# EAGLE design mainboard_3 (EAGLE 7.3.0)
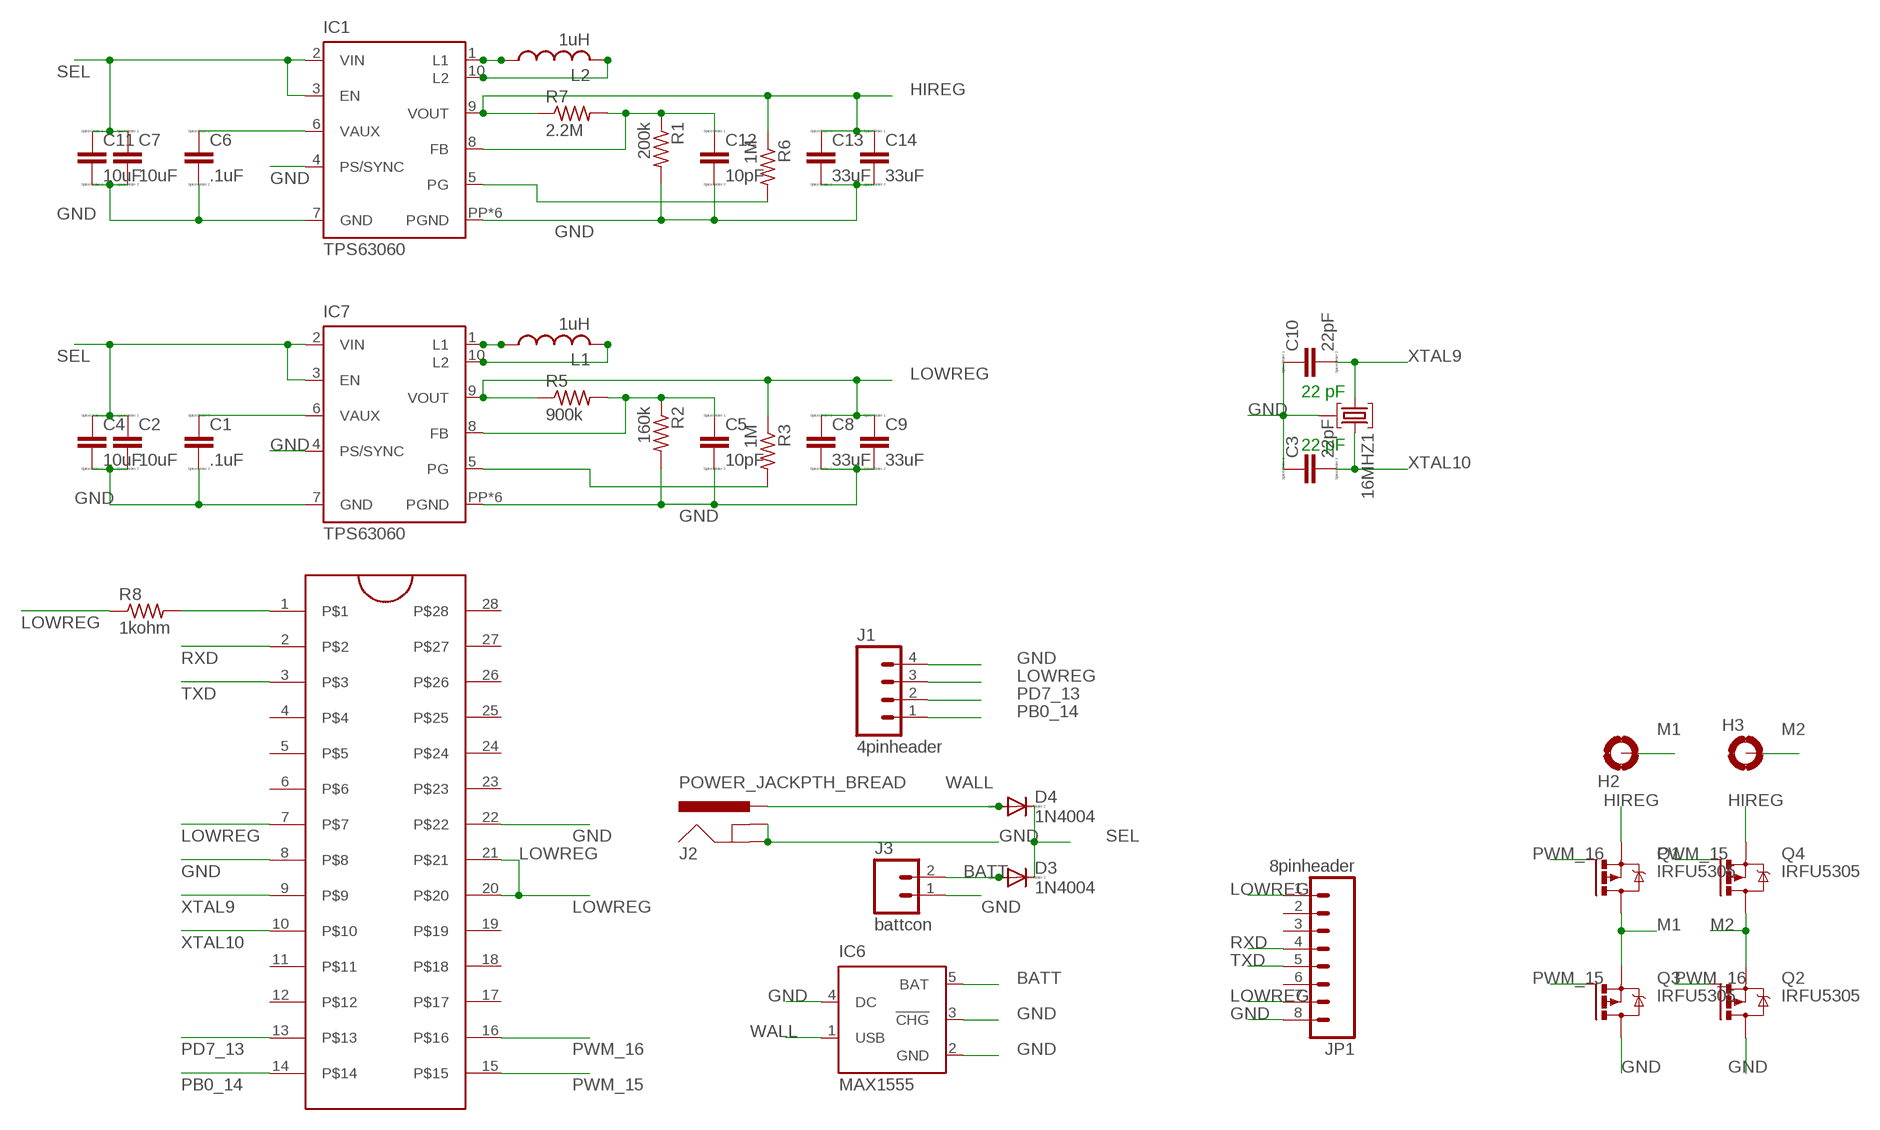
[diagram p0: schematic, sheet 1]

## Parts
16MHZ1  HC49-HC49-3L  [HC49-3L]
C1  .1uF  C  [C0805]
C2  10uF  CC3216  [C3216]
C3  22pF  C  [C0805]
C4  10uF  CC3216  [C3216]
C5  10pF  CC1206  [C1206]
C6  .1uF  C  [C0805]
C7  10uF  CC3216  [C3216]
C8  33uF  CC3216  [C3216]
C9  33uF  CC3216  [C3216]
C10  22pF  C  [C0805]
C11  10uF  CC3216  [C3216]
C12  10pF  CC1206  [C1206]
C13  33uF  CC3216  [C3216]
C14  33uF  CC3216  [C3216]
D3  1N4004  [DO41-10]
D4  1N4004  [DO41-10]
H2  MOUNT-PAD-ROUND4.1  [4,1-PAD]
H3  MOUNT-PAD-ROUND4.1  [4,1-PAD]
IC1  TPS63060  [DSC-S-PWSON-N10]
IC6  MAX1555  [SOT23-5L]
IC7  TPS63060  [DSC-S-PWSON-N10]
J1  4pinheader  M04LONGPADS  [1X04_LONGPADS]
J2  POWER_JACKPTH_BREAD  [POWER_JACK_PTH_BREAD]
J3  battcon  M02JST-PTH-VERT  [JST-2-PTH-VERT]
JP1  8pinheader  M08LONGPADS  [1X08_LONGPADS]
L1  1uH  L-USL4532P  [L4532P]
L2  1uH  L-USL4532P  [L4532P]
Q1  IRFU5305  [I-PAK_TO251AA]
Q2  IRFU5305  [I-PAK_TO251AA]
Q3  IRFU5305  [I-PAK_TO251AA]
Q4  IRFU5305  [I-PAK_TO251AA]
R1  200k  R-US_M0805  [M0805]
R2  160k  R-US_M0805  [M0805]
R3  1M  R-US_M0805  [M0805]
R5  900k  R-US_M3216  [M3216]
R6  1M  R-US_M0805  [M0805]
R7  2.2M  R-US_M3216  [M3216]
R8  1kohm  R-US_M0805  [M0805]
U$1  ZIFSOCKET-28-3ZIFFSOCKET-28-3  [DIL28-3-ZIF_SOCKET]

## Nets
BATT: D3.A IC6.5(BAT) J3.2
GND: 16MHZ1.2 C1.2 C2.2 C3.1 C4.2 C5.2 C6.2 C7.2 C8.2 C9.2 C10.1 C11.2 C12.2 C13.2 C14.2 IC1.4(PS/SYNC) IC1.7(GND) IC1.PP(PGND) IC1.PP@1(PGND) IC1.PP@2(PGND) IC1.PP@3(PGND) IC1.PP@4(PGND) IC1.PP@7(PGND) IC6.2(GND) IC6.3(!CHG) IC6.4(DC) IC7.4(PS/SYNC) IC7.7(GND) IC7.PP(PGND) IC7.PP@1(PGND) IC7.PP@2(PGND) IC7.PP@3(PGND) IC7.PP@4(PGND) IC7.PP@7(PGND) J1.4 J2.GND J2.GNDBREAK J3.1 JP1.8 Q2.2(D) Q3.2(D) R1.2 R2.2 U$1.8 U$1.22
HIREG: C13.1 C14.1 IC1.9(VOUT) Q1.3(S) Q4.3(S) R6.1 R7.1
LOWREG: C8.1 C9.1 IC7.9(VOUT) J1.3 JP1.1 JP1.7 R3.1 R5.1 R8.1 U$1.7 U$1.20 U$1.21
M1: H2.B4,1(MOUNT) Q1.2(D) Q3.3(S)
M2: H3.B4,1(MOUNT) Q2.3(S) Q4.2(D)
N$1: R8.2 U$1.1
N$3: IC1.1(L1) L2.1
N$4: IC7.1(L1) L1.1
N$5: IC7.10(L2) L1.2
N$8: IC1.10(L2) L2.2
N$9: C5.1 IC7.8(FB) R2.1 R5.2
N$10: C12.1 IC1.8(FB) R1.1 R7.2
N$11: C1.1 IC7.6(VAUX)
N$12: IC1.5(PG) R6.2
N$13: IC7.5(PG) R3.2
N$14: C6.1 IC1.6(VAUX)
PB0_14: J1.1 U$1.14
PD7_13: J1.2 U$1.13
PWM_15: Q3.1(G) Q4.1(G) U$1.15
PWM_16: Q1.1(G) Q2.1(G) U$1.16
RXD: JP1.4 U$1.2
SEL: C2.1 C4.1 C7.1 C11.1 D3.C D4.C IC1.2(VIN) IC1.3(EN) IC7.2(VIN) IC7.3(EN)
TXD: JP1.5 U$1.3
WALL: D4.A IC6.1(USB) J2.PWR
XTAL9: 16MHZ1.1 C10.2 U$1.9
XTAL10: 16MHZ1.3 C3.2 U$1.10
Unconnected: JP1.2 JP1.3 JP1.6 U$1.4 U$1.5 U$1.6 U$1.11 U$1.12 U$1.17 U$1.18 U$1.19 U$1.23 U$1.24 U$1.25 U$1.26 U$1.27 U$1.28

## Notes on the sheet
- 22 pF
- 22 pF

## Library data of the parts
16MHZ1 = IQD-Frequency-Products:HC49: Crystals; MFD: IQD Frequency Products
C1-C14 = eagle-ltspice:C: CAPACITOR, European symbol; SPICEMODEL: NONE; SPICEPREFIX: C
D3 D4 = diode:1N4004: DIODE general purpose rectifier, 1 A
H2 H3 = holes:MOUNT-PAD-ROUND: MOUNTING PAD, round
IC1 IC7 = ARNAV445:TPS6306*: HIGH INPUT VOLTAGE BUCK-BOOST CONVERTER WITH 2A SWITCH CURRENT Source: http://www.ti.com/lit/ds/symlink/tps63060.pdf
IC6 = maxim:MAX1555: Dual-Input USB/AC Adapter 1-Cell Li+ Battery Chargers Source: http://www.maxim-ic.com .. MAX1551-MAX1555.pdf; MF: MAXIM; MPN: MAX1555EZK+T; OC_FARNELL: 1628222; OC_NEWARK: 59J2761
J1 = SparkFun-Connectors:M04: Header 4 Standard 4-pin 0.1" header. Use with straight break away headers (SKU : PRT-00116), right angle break away headers (PRT-00553), swiss pins (PRT-00743), machine pins (PRT-00117), and female headers (PRT-00115). Molex polarized connector foot print use with SKU : PRT-08231 with associated crimp pins and housings. 1MM SMD Version SKU: PRT-10208; PROD_ID: CONN-09696
J2 = SparkFun-Connectors:POWER_JACK: Power Jack This is the standard 5.5mm barrel jack for power. The PTH is the most common, proven, reliable, footprint. The Slot footprint only works if the mill layer is transmitted to the PCB fab house so be warned. Mating wall wart : TOL-00298 (and others); PROD_ID: PRT-10811
J3 = SparkFun-Connectors:M02: Standard 2-pin 0.1" header. Use with - straight break away headers ( PRT-00116) - right angle break away headers (PRT-00553) - swiss pins (PRT-00743) - machine pins (PRT-00117) - female headers (PRT-00115) Molex polarized connector foot print use with: PRT-08233 with associated crimp pins and housings. 2.54_SCREWTERM for use with PRT-10571. 3.5mm Screw Terminal footprints for PRT-08084 5mm Screw Terminal footprints for use with PRT-08432
JP1 = SparkFun-Connectors:M08: Header 8 Standard 8-pin 0.1" header. Use with straight break away headers (SKU : PRT-00116), right angle break away headers (PRT-00553), swiss pins (PRT-00743), machine pins (PRT-00117), and female headers (PRT-00115).
L1 L2 = rcl:L-US: INDUCTOR, American symbol
Q1-Q4 = transistor-power:IRF?5305: HEXFET Power MOSFET Source: http://www.irf.com/product-info/datasheets/data/irfr5305pbf.pdf
R1-R3 R5-R8 = rcl:R-US_: RESISTOR, American symbol
U$1 = SparkFun-Connectors:ZIFSOCKET-28-3: Lever-action ZIF socket for 28-pin ICs

## Board
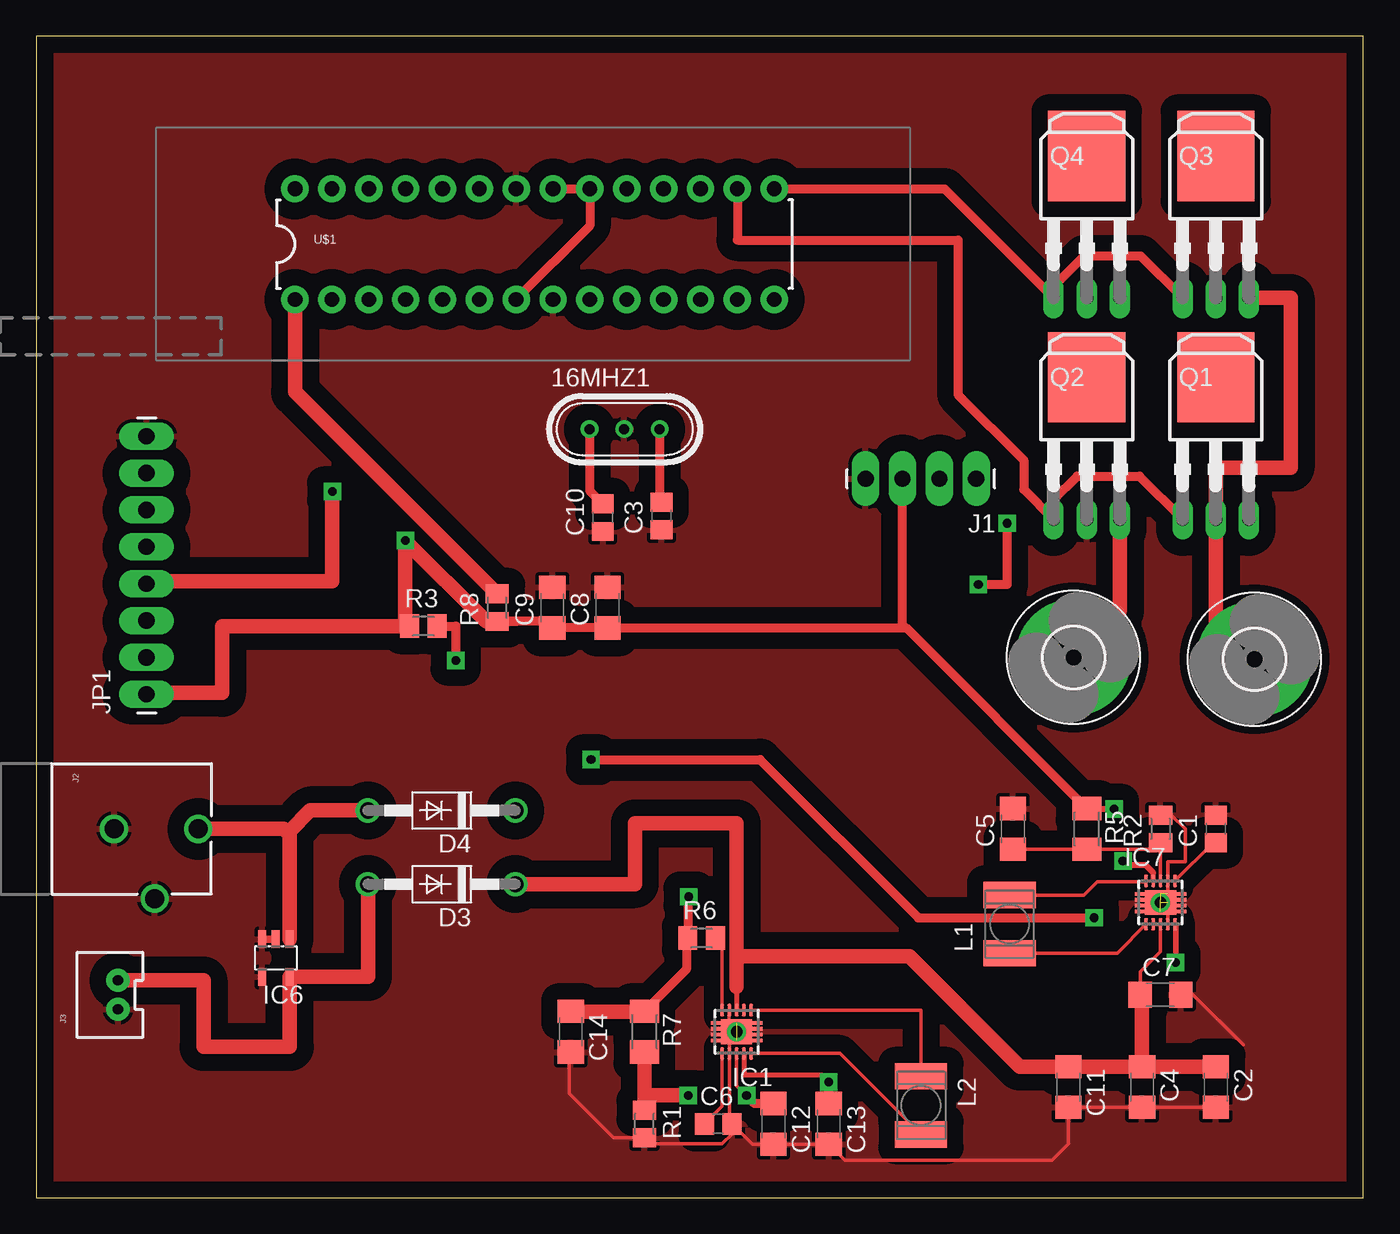
[diagram p1: board, top side]
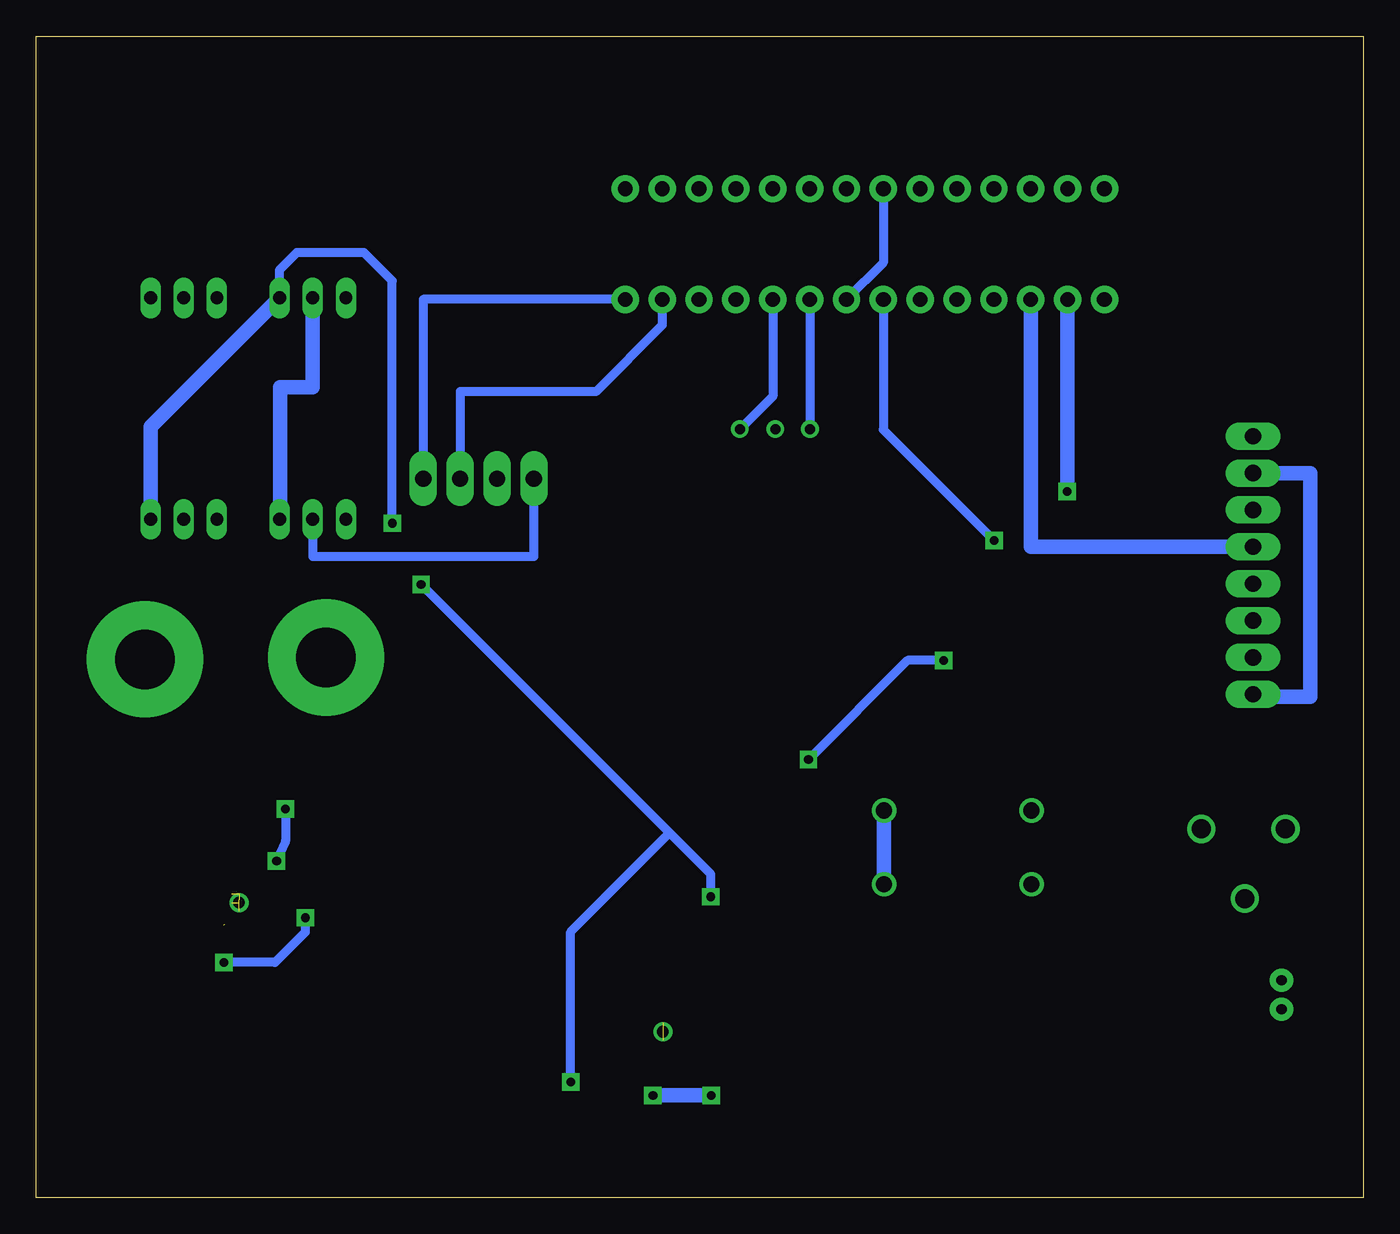
[diagram p2: board, bottom side, seen from below]

Size 91.44 x 80 mm. Coordinates in mm from the lower left corner, seen from the top.
Outline: 0,0 91.44,0 91.44,80 0,80 0,0
Copper layers (1*16): Top 0.035mm / dielectric 1.5mm / Bottom 0.035mm
Design rules "MWSEagleDesignRules2": minimum track width 13mil, minimum drill 22mil, track to track 13mil, track to pad 13mil, pad to pad 13mil, via to via 13mil, smd to smd 8mil, copper to edge 40mil, drill to drill 8mil, minimum pad ring 10mil, minimum via ring 8mil, stop-mask expansion 4mil, vias tented up to drill 0mil, thermal gap 10mil

### Footprints (pad centres in the part's own frame; a part is rotated, then mirrored left to right if it is on the bottom)
HC49-3L = drill 0.7 pad 1.2: 1 -2.413,0; 2 -0.027,0; 3 2.413,0
C0805 = smd 1.3 x 1.5: 1 -0.95,0; 2 0.95,0
C3216 = smd 1.6 x 1.8: 1 -1.4,0; 2 1.4,0
C1206 = smd 1.6 x 1.8: 1 -1.4,0; 2 1.4,0
DO41-10 = drill 1.118: A 5.08,0; C -5.08,0
4,1-PAD = drill 4.1 pad 8: B4,1 0,0
DSC-S-PWSON-N10 = smd 0.28 x 0.85: 1 -1,-1.488; 2 -0.5,-1.488; 3 0,-1.488; 4 0.5,-1.488; 5 1,-1.488; 6 1,1.5; 7 0.5,1.5; 8 0,1.5; 9 -0.5,1.5; 10 -1,1.5 | smd 2.15 x 1.7: PP 0,0 | smd 3.55 x 0.25: PP@1 0,0.6; PP@2 0,0.2; PP@3 0,-0.2; PP@4 0,-0.6 | drill 0.8: PP@7 0,0
SOT23-5L = smd 0.55 x 1.2: 1 -0.95,-1.3; 2 0,-1.3; 3 0.95,-1.3; 4 0.95,1.3; 5 -0.95,1.3
1X04_LONGPADS = drill 1.118 pad 1.88 long: 1 0,0; 2 2.54,0; 3 5.08,0; 4 7.62,0
POWER_JACK_PTH_BREAD = drill 1.3: GND 0,7.9; GNDBREAK 4.8,10.7; PWR 0,13.7
JST-2-PTH-VERT = drill 0.7 pad 1.6: 1 -1,-0.55; 2 1,-0.55
1X08_LONGPADS = drill 1.118 pad 1.88 long: 1 0,0; 2 2.54,0; 3 5.08,0; 4 7.62,0; 5 10.16,0; 6 12.7,0; 7 15.24,0; 8 17.78,0
L4532P = smd 1.8 x 3.6: 1 -2,0; 2 2,0
I-PAK_TO251AA = drill 0.889 long: 1 -2.286,-5.334; 2 0,-5.334; 3 2.286,-5.334 | smd 5.334 x 6.223: 4 0,4.445
M0805 = smd 1.3 x 1.6: 1 -0.95,0; 2 0.95,0
M3216 = smd 1.6 x 2: 1 -1.4,0; 2 1.4,0
DIL28-3-ZIF_SOCKET = drill 1.016 pad 1.88: 1 -16.51,-3.81; 2 -13.97,-3.81; 3 -11.43,-3.81; 4 -8.89,-3.81; 5 -6.35,-3.81; 6 -3.81,-3.81; 7 -1.27,-3.81; 8 1.27,-3.81; 9 3.81,-3.81; 10 6.35,-3.81; 11 8.89,-3.81; 12 11.43,-3.81; 13 13.97,-3.81; 14 16.51,-3.81; 15 16.51,3.81; 16 13.97,3.81; 17 11.43,3.81; 18 8.89,3.81; 19 6.35,3.81; 20 3.81,3.81; 21 1.27,3.81; 22 -1.27,3.81; 23 -3.81,3.81; 24 -6.35,3.81; 25 -8.89,3.81; 26 -11.43,3.81; 27 -13.97,3.81; 28 -16.51,3.81

### Placement (x,y rotation side)
16MHZ1  40.54,52.93 0 top
C1  81.28,25.4 90 top
C2  81.28,7.62 270 top
C3  43.08,46.96 90 top
C4  76.2,7.62 270 top
C5  67.31,25.4 90 top
C6  46.99,5.08 0 top
C7  77.47,13.97 0 top
C8  39.37,40.64 90 top
C9  35.56,40.64 90 top
C10  39.04,46.84 90 top
C11  71.12,7.62 270 top
C12  50.8,5.08 270 top
C13  54.61,5.08 270 top
C14  36.83,11.43 270 top
D3  27.94,21.59 180 top
D4  27.94,26.67 180 top
H2  83.95,37.08 0 top
H3  71.48,37.21 0 top
IC1  48.26,11.43 180 top
IC6  16.51,16.51 180 top
IC7  77.47,20.32 0 top
J1  64.77,49.53 180 top
J2  -2.54,25.4 270 top
J3  5.08,13.97 90 top
JP1  7.59,34.67 90 top
L1  67.08,18.85 90 top
L2  60.96,6.35 270 top
Q1  81.28,52.07 0 top
Q2  72.39,52.07 0 top
Q3  81.28,67.31 0 top
Q4  72.39,67.31 0 top
R1  41.91,5.08 270 top
R2  77.47,25.4 90 top
R3  26.67,39.37 0 top
R5  72.39,25.4 270 top
R6  45.85,17.88 0 top
R7  41.91,11.43 270 top
R8  31.75,40.64 90 top
U$1  34.34,65.68 0 top

### Tracks (layer width: path | path; a pad name or v marks a point on that pad's centre or on a via)
BATT
  Top 1.016: D3.A 22.86,15.21 IC6.5 17.46,10.39 11.53,10.39 11.53,14.97 J3.2
GND  (10 unrouted)
  Top 0.254: 81.33,6.27 C2.2 C4.2 C11.2 71.12,3.71 69.98,2.57 55.72,2.57 C13.2 C12.2 49.34,3.68 C6.2 | C7.2 79.7,13.97 83.16,10.52 | C14.2 36.73,9.93 36.73,7.19 39.79,4.13 R1.2 42.33,3.71 47.27,3.71 47.94,4.38 C6.2 | C10.1 39.26,45.89 | R2.2 78.22,26.35 79.17,25.4 79.17,23.14 77.97,23.14 IC7.7 | 77.93,21.86 IC7.7 | 77.97,20.92 IC7.7 | 77.97,20.32 IC7.4 | C6.2 47.76,5.08 IC1.7 47.76,10.83 IC1.PP@1 | IC1.4 47.75,11.43 IC1.PP@7
  Top 0.508: IC6.3 IC6.2
  Bottom 0.61: Q2.2 72.39,44.17 57.15,44.17 J1.4 | U$1.22 33.07,64.41 U$1.8
  pour Top (isolate 1.143): 1.27,78.74 90.17,78.74 90.17,1.27 1.27,1.27
HIREG  (via drill 0.6)
  Top 0.254: 41.88,12.8 R7.1
  Top 0.356: v54.61,7.98 54.13,8.46 48.76,8.46 IC1.9
  Top 0.61: v44.96,20.73 44.96,17.88 R6.1 44.81,17.78 44.81,15.73 R7.1 | v64.92,42.24 66.9,42.24 v66.9,46.46 | C13.1 v54.61,7.98
  Top 1.016: 41.88,12.8 36.83,12.8 C14.1
  Bottom 0.61: v44.96,20.73 44.96,22.28 47.8,25.12 | 47.8,25.12 v64.92,42.24 | v66.9,46.46 66.9,63.14 68.86,65.1 73.48,65.1 74.7,63.88 74.7,62 Q4.3 | v54.61,7.98 54.61,18.31 47.8,25.12
  Bottom 1.016: Q1.3 83.57,53.09 Q4.3
LOWREG  (via drill 0.6)
  Top 0.254: 74.24,26.8 v74.27,26.77 | 35.56,39.69 C9.1 | 76.99,21.82 IC7.9
  Top 0.356: IC7.9 76.97,22.39
  Top 0.381: 76.97,22.39 76.45,22.91
  Top 0.406: R5.1 74.24,26.8 | 76.45,22.91 75.16,22.91 v74.88,23.19
  Top 0.61: C9.1 C8.1 59.69,39.24 | 35.56,39.69 R8.1 33.07,39.69 | 59.69,39.24 J1.3 | 59.69,39.24 59.95,39.24 R5.1 | U$1.7 38.15,66.95 U$1.20 U$1.21 | 25.43,39.66 R3.1
  Top 1.016: 25.43,39.66 v25.43,45.26 31,39.69 R8.1 | R3.1 12.8,39.37 12.8,34.77 7.6,34.77 JP1.1
  Bottom 0.254: 7.6,49.99 JP1.7
  Bottom 0.61: v74.27,26.77 74.27,24.56 v74.88,23.19 | U$1.7 33.07,52.91 v25.43,45.26
  Bottom 1.016: JP1.7 3.63,49.91 3.63,34.52 7.6,34.52 JP1.1
M1
  Top 1.016: H2.B4,1 81.28,39.75 Q1.2 81.28,50.29 86.44,50.29 86.44,61.98 Q3.3
M2
  Top 1.016: Q2.3 74.68,40.41 H3.B4,1
  Bottom 1.016: Q2.3 74.62,46.74 74.62,55.83 72.39,55.83 Q4.2
N$1
  Top 1.016: U$1.1 17.83,55.51 R8.2
N$3
  Top 0.254: IC1.1 60.96,12.92 L2.1
N$4
  Top 0.254: L1.1 74.48,16.85 IC7.1
N$5
  Top 0.254: L1.2 72.21,20.85 73.13,21.77 76.42,21.77 IC7.10 76.45,21.82
N$8
  Top 0.254: L2.2 55.38,9.93 IC1.10
N$9
  Top 0.254: C5.1 R5.2 77.02,24 R2.1 IC7.8
N$10  (via drill 0.6)
  Top 0.254: 48.26,9.02 IC1.8 48.26,7.72 v48.95,7.04
  Top 0.61: C12.1 49.5,6.48 v48.95,7.04
  Top 1.016: R7.2 41.91,7.04 | 41.91,7.04 R1.1 | v44.93,7.04 41.91,7.04
  Bottom 1.016: v44.93,7.04 v48.95,7.04
N$11
  Top 0.254: C1.1 81.1,24.45 IC7.6
N$12
  Top 0.254: R6.2 47.26,17.88 IC1.5
N$13  (via drill 0.6)  (1 unrouted)
  Top 0.381: v78.51,16.21 78.51,18.79
  Top 0.61: R3.2 28.9,39.37 v28.9,37.01 | v38.23,30.18 49.89,30.18 60.78,19.28 v72.9,19.28
  Bottom 0.61: v28.9,37.01 31.39,37.01 v38.23,30.18 | v72.9,19.28 72.9,18.29 74.98,16.21 v78.51,16.21
N$14
  Top 0.254: IC1.6 47.26,6.3 C6.1
PB0_14
  Bottom 0.61: U$1.14 64.77,61.87 J1.1
PD7_13
  Bottom 0.61: U$1.13 48.31,60.1 52.88,55.52 62.23,55.52 J1.2
PWM_15
  Top 0.61: U$1.15 62.59,69.49 Q4.1 70.1,62.76 72.21,64.87 76.1,64.87 Q3.1
PWM_16
  Top 0.61: U$1.16 48.31,65.96 63.52,65.96 63.52,55.32 68.05,50.8 68.05,48.79 Q2.1 70.1,48.08 71.73,49.71 76.02,49.71 Q1.1
RXD  (via drill 0.6)
  Top 1.016: v20.4,48.64 20.4,42.47 7.6,42.47 JP1.4
  Bottom 1.016: U$1.2 20.4,61.87 v20.4,48.64
SEL
  Top 0.254: 76.07,9.15 C4.1 | IC1.3 IC1.2 | IC7.2 IC7.3 77.44,18.81 77.44,16.94 76.07,15.57 C7.1
  Top 0.356: 48.26,14.53 IC1.3
  Top 1.016: D3.C 41.25,21.59 41.25,25.78 48.26,25.78 48.26,16.46 | 48.26,16.46 48.26,14.53 | C4.1 C11.1 67.76,9.02 60.17,16.61 48.41,16.61 48.26,16.46 | C4.1 C2.1 | C7.1 76.2,13.97 C4.1
  Bottom 1.016: D4.C D3.C
TXD
  Bottom 1.016: JP1.5 22.91,44.83 U$1.3
WALL
  Top 0.991: 17.46,25.25 17.46,24.99 IC6.1
  Top 1.016: J2.PWR 17.05,25.4 17.46,24.99 | D4.A 18.88,26.67 17.46,25.25
XTAL9
  Top 0.61: 16MHZ1.1 38.12,48.7 C10.2
  Bottom 0.61: U$1.9 38.12,61.87 16MHZ1.1
XTAL10
  Top 0.61: 16MHZ1.3 42.95,48.04 C3.2
  Bottom 0.61: U$1.10 40.69,55.19 16MHZ1.3